# EAGLE design tarocco-v1.1 (EAGLE 7.3.0)
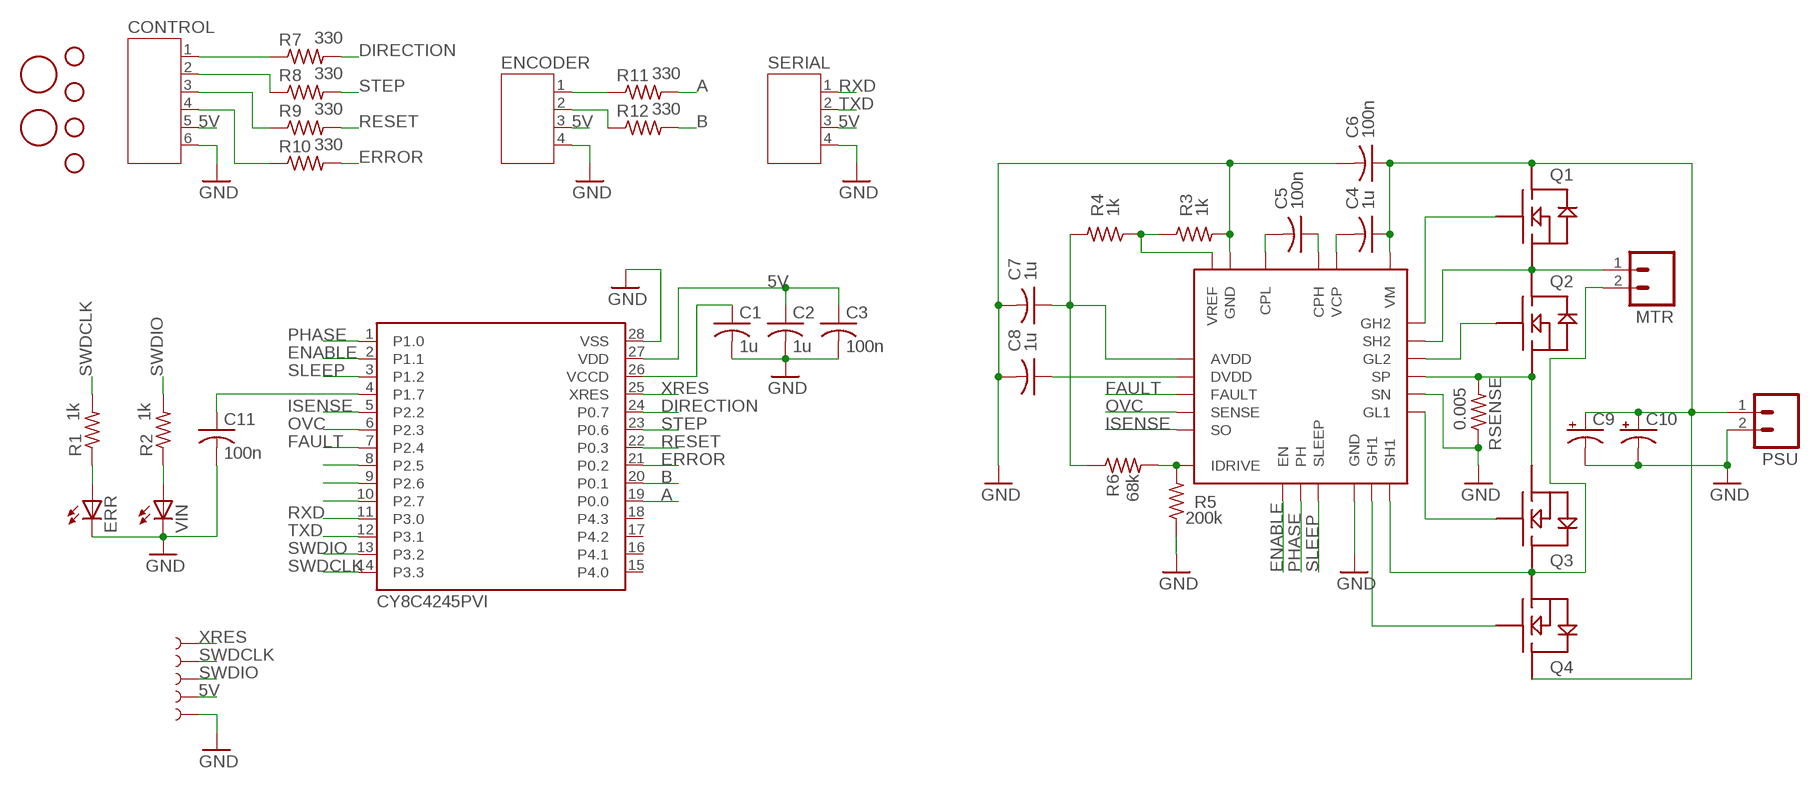
[diagram p0: schematic, sheet 1]

## Parts
8701  DRV8701  [VQFN24]
C1  1u  C-USC0603  [C0603]
C2  1u  C-USC0603  [C0603]
C3  100n  C-USC0603  [C0603]
C4  1u  C-USC0603  [C0603]
C5  100n  C-USC0603  [C0603]
C6  100n  C-USC0603  [C0603]
C7  1u  C-USC0603  [C0603]
C8  1u  C-USC0603  [C0603]
C9  CPOL-USE3.5-8  [E3,5-8]
C10  CPOL-USE3.5-8  [E3,5-8]
C11  100n  C-USC0603  [C0603]
CONTROL  JST-PH6  [JST-PH6]
ENCODER  JST-PH4  [JST-PH4]
ERR  LEDCHIP-LED0603  [CHIP-LED0603]
IC1  CY8C4545PVI  [SSOP28]
MTR  M023.5MM  [SCREWTERMINAL-3.5MM-2]
PSU  M023.5MM  [SCREWTERMINAL-3.5MM-2]
Q1  NEXFET_SINGLECSD18537NQ5A  [SON5X6]
Q2  NEXFET_SINGLECSD18537NQ5A  [SON5X6]
Q3  NEXFET_SINGLECSD18537NQ5A  [SON5X6]
Q4  NEXFET_SINGLECSD18537NQ5A  [SON5X6]
R1  1k  R-US_R0603  [R0603]
R2  1k  R-US_R0603  [R0603]
R3  1k  R-US_R0603  [R0603]
R4  1k  R-US_R0603  [R0603]
R5  200k  R-US_R0603  [R0603]
R6  68k  R-US_R0603  [R0603]
R7  330  R-US_R0603  [R0603]
R8  330  R-US_R0603  [R0603]
R9  330  R-US_R0603  [R0603]
R10  330  R-US_R0603  [R0603]
R11  330  R-US_R0603  [R0603]
R12  330  R-US_R0603  [R0603]
RSENSE  0.005  R-US_R2512  [R2512]
SERIAL  JST-PH4  [JST-PH4]
STANDOFF1  STAND-OFF  [STAND-OFF]
STANDOFF2  STAND-OFF  [STAND-OFF]
STANDOFF3  STAND-OFF  [STAND-OFF]
STANDOFF4  STAND-OFF  [STAND-OFF]
TP1  TEST-POINT3X5  [PAD.03X.05]
TP2  TEST-POINT3X5  [PAD.03X.05]
TP3  TEST-POINT3X5  [PAD.03X.05]
TP4  TEST-POINT3X5  [PAD.03X.05]
TP5  TEST-POINT3X5  [PAD.03X.05]
U$1  FIDUCIAL  [FIDUCIAL_1MM]
U$3  FIDUCIAL  [FIDUCIAL_1MM]
VIN  LEDCHIP-LED0603  [CHIP-LED0603]

## Nets
5V: C2.1 C3.1 CONTROL.5 ENCODER.3 IC1.27(VDD) SERIAL.3 TP4.P$1
A: IC1.19(P0.0) R11.2
B: IC1.20(P0.1) R12.2
DIRECTION: IC1.24(P0.7) R7.2
ENABLE: 8701.EN IC1.2(P1.1)
ERROR: IC1.21(P0.2) R10.2
FAULT: 8701.FAULT IC1.7(P2.4)
GND: 8701.GND@1(GND) 8701.GND@2(GND) 8701.GND@3(GND) 8701.SN C1.2 C2.2 C3.2 C6.2 C7.2 C8.2 C9.- C10.- C11.2 CONTROL.6 ENCODER.4 ERR.C IC1.28(VSS) PSU.2 R3.2 R5.1 RSENSE.1 SERIAL.4 TP5.P$1 VIN.C
ISENSE: 8701.SO IC1.5(P2.2)
N$1: 8701.GL1 Q3.GATE
N$2: 8701.SH1 MTR.2 Q3.DRAIN@1(DRAIN) Q3.DRAIN@2(DRAIN) Q3.DRAIN@3(DRAIN) Q3.DRAIN@4(DRAIN) Q3.DRAIN@5(DRAIN) Q4.SOURCE@1(SOURCE) Q4.SOURCE@2(SOURCE) Q4.SOURCE@3(SOURCE)
N$3: 8701.SH2 MTR.1 Q1.SOURCE@1(SOURCE) Q1.SOURCE@2(SOURCE) Q1.SOURCE@3(SOURCE) Q2.DRAIN@1(DRAIN) Q2.DRAIN@2(DRAIN) Q2.DRAIN@3(DRAIN) Q2.DRAIN@4(DRAIN) Q2.DRAIN@5(DRAIN)
N$4: 8701.GH2 Q1.GATE
N$5: 8701.SP Q2.SOURCE@1(SOURCE) Q2.SOURCE@2(SOURCE) Q2.SOURCE@3(SOURCE) Q3.SOURCE@1(SOURCE) Q3.SOURCE@2(SOURCE) Q3.SOURCE@3(SOURCE) RSENSE.2
N$6: 8701.GL2 Q2.GATE
N$7: 8701.GH1 Q4.GATE
N$8: ENCODER.1 R11.1
N$10: ENCODER.2 R12.1
N$11: 8701.VCP C4.2
N$12: 8701.CPL C5.2
N$13: 8701.CPH C5.1
N$14: CONTROL.1 R7.1
N$15: 8701.VREF R3.1 R4.1
N$16: 8701.AVDD C7.1 R4.2 R6.1
N$17: 8701.DVDD C8.1
N$18: CONTROL.2 R8.1
N$19: C1.1 IC1.26(VCCD)
N$20: CONTROL.3 R9.1
N$21: 8701.IDRIVE R5.2 R6.2
N$22: CONTROL.4 R10.1
N$23: 8701.VM C4.1 C6.1 C9.+ C10.+ PSU.1 Q1.DRAIN@1(DRAIN) Q1.DRAIN@2(DRAIN) Q1.DRAIN@3(DRAIN) Q1.DRAIN@4(DRAIN) Q1.DRAIN@5(DRAIN) Q4.DRAIN@1(DRAIN) Q4.DRAIN@2(DRAIN) Q4.DRAIN@3(DRAIN) Q4.DRAIN@4(DRAIN) Q4.DRAIN@5(DRAIN)
N$24: ERR.A R1.1
N$25: R2.1 VIN.A
N$29: C11.1 IC1.4(P1.7)
N$33: IC1.8(P2.5)
N$34: IC1.9(P2.6)
N$35: IC1.10(P2.7)
OVC: 8701.SENSE IC1.6(P2.3)
PHASE: 8701.PH IC1.1(P1.0)
RESET: IC1.22(P0.3) R9.2
RXD: IC1.11(P3.0) SERIAL.1
SLEEP: 8701.SLEEP IC1.3(P1.2)
STEP: IC1.23(P0.6) R8.2
SWDCLK: IC1.14(P3.3) R1.2 TP2.P$1
SWDIO: IC1.13(P3.2) R2.2 TP3.P$1
TXD: IC1.12(P3.1) SERIAL.2
XRES: IC1.25(XRES) TP1.P$1
Unconnected: IC1.15(P4.0) IC1.16(P4.1) IC1.17(P4.2) IC1.18(P4.3)

## Notes on the sheet
- CY8C4245PVI

## Library data of the parts
8701 = drv8x:DRV8701
C1-C8 C11 = adafruit:C-US: CAPACITOR, American symbol
C9 C10 = adafruit:CPOL-US: POLARIZED CAPACITOR, American symbol
CONTROL = jst-ph:JST-PH6
ENCODER SERIAL = jst-ph:JST-PH4
ERR VIN = adafruit:LED: LED OSRAM: - CHIPLED LG R971, LG N971, LY N971, LG Q971, LY Q971, LO R971, LY R971 LH N974, LH R974 LS Q976, LO Q976, LY Q976 LO Q996 - Hyper CHIPLED LW Q18S LB Q993, LB Q99A, LB R99A - SideLED LS A670, LO A670, LY A670, LG A670, LP A670 LB A673, LV A673, LT A673, LW A673 LH A674 LY A675 LS A676, LA A676, LO A676, LY A676, LW A676 LS A679, LY A679, LG A679 - Hyper Micro SIDELED® LS Y876, LA Y876, LO Y876, LY Y876 LT Y87S - SmartLED LW L88C, LW L88S LB L89C, LB L89S, LG L890 LS L89K, LO L89K, LY L89K LS L896, LA L896, LO L896, LY L896 - TOPLED LS T670, LO T670, LY T670, LG T670, LP T670 LSG T670, LSP T670, LSY T670, LOP T670, LYG T670 LG T671, LOG T671, LSG T671 LB T673, LV T673, LT T673, LW T673 LH T674 LS T676, LA T676, LO T676, LY T676, LB T676, LH T676, LSB T676, LW T676 LB T67C, LV T67C, LT T67C, LS T67K, LO T67K, LY T67K, LW E67C LS E67B, LA E67B, LO E67B, LY E67B, LB E67C, LV E67C, LT E67C LW T67C LS T679, LY T679, LG T679 LS T770, LO T770, LY T770, LG T770, LP T770 LB T773, LV T773, LT T773, LW T773 LH T774 LS E675, LA E675, LY E675, LS T675 LS T776, LA T776, LO T776, LY T776, LB T776 LHGB T686 LT T68C, LB T68C - Hyper Mini TOPLED® LB M676 - Mini TOPLED Santana® LG M470 LS M47K, LO M47K, LY M47K Source: http://www.osram.convergy.de/
IC1 = CY8C4200:CY8C4545PVI: CY8C4245 SSOP-28
MTR PSU = SparkFun-Connectors:M02: Standard 2-pin 0.1" header. Use with - straight break away headers ( PRT-00116) - right angle break away headers (PRT-00553) - swiss pins (PRT-00743) - machine pins (PRT-00117) - female headers (PRT-00115) Molex polarized connector foot print use with: PRT-08233 with associated crimp pins and housings. 2.54_SCREWTERM for use with PRT-10571. 3.5mm Screw Terminal footprints for PRT-08084 5mm Screw Terminal footprints for use with PRT-08432
Q1-Q4 = mosfet:NEXFET_SINGLE
R1-R12 RSENSE = adafruit:R-US_: RESISTOR, American symbol
STANDOFF1-STANDOFF4 = SparkFun-Electromechanical:STAND-OFF: #4 Stand Off This is the mechanical footprint for a #4 phillips button head screw. Use the keepout ring to avoid running the screw head into surrounding components. SKU : PRT-00447
TP1-TP5 = SparkFun-Passives:TEST-POINT: Bare copper test points for troubleshooting or ICT
U$1 U$3 = adafruit:FIDUCIAL: For use by pick and place machines to calibrate the vision/machine, 1mm By microbuilder.eu

## Board
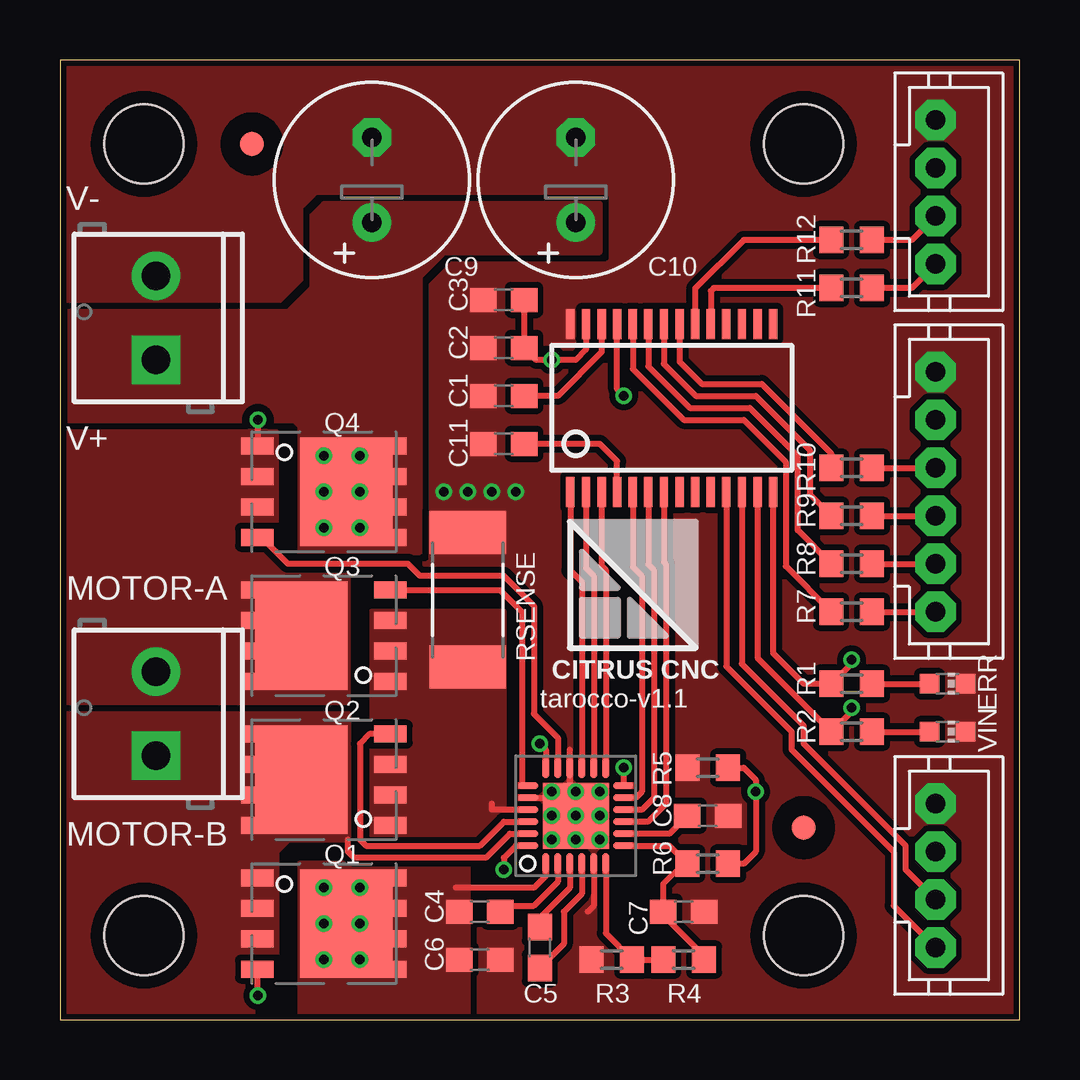
[diagram p1: board, top side]
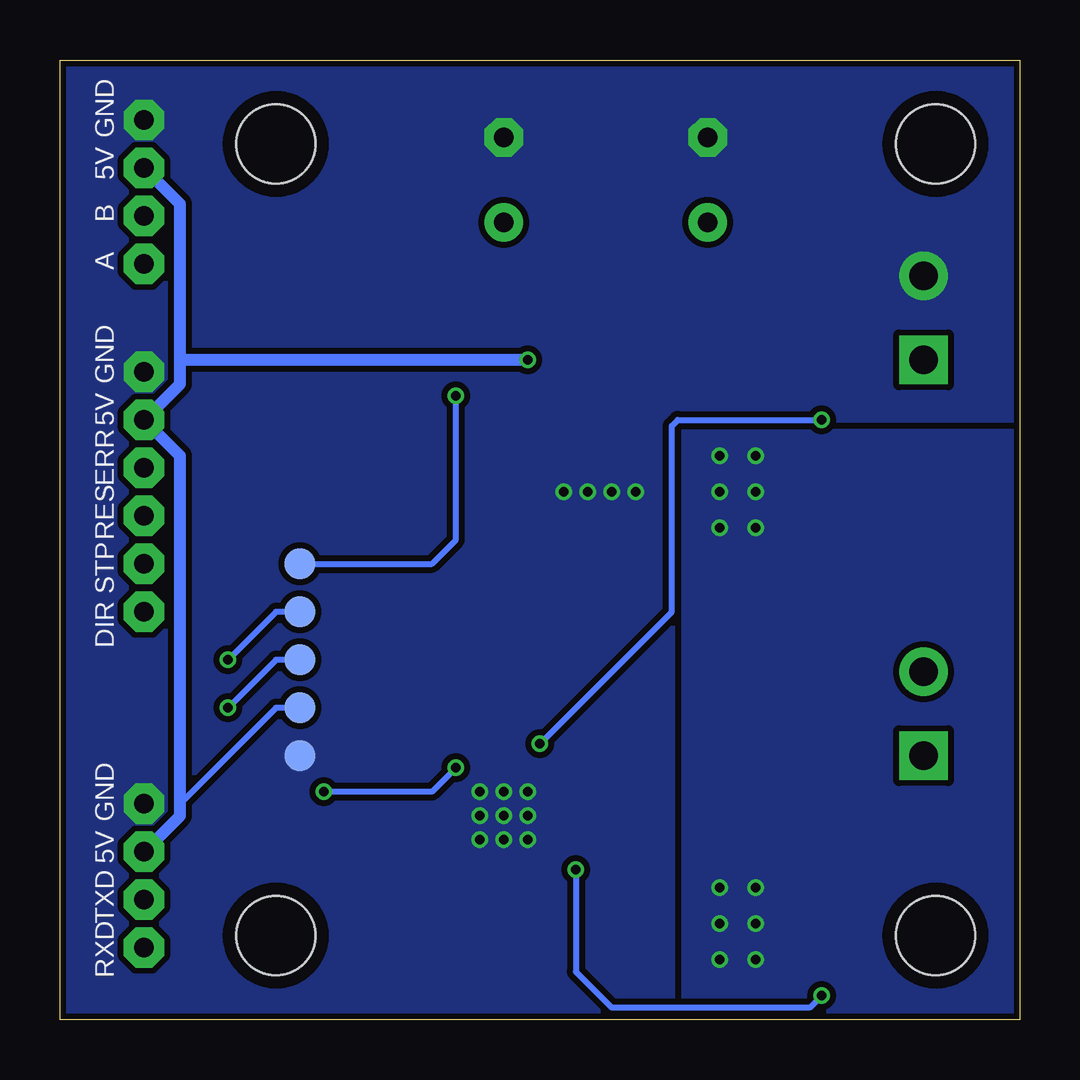
[diagram p2: board, bottom side, seen from below]

Size 40 x 40 mm. Coordinates in mm from the lower left corner, seen from the top.
Outline: 0,0 40,0 40,40 0,40 0,0
Copper layers (1*16): Top 0.035mm / dielectric 1.5mm / Bottom 0.035mm
Design rules "MF_Standard_2_Layer": minimum track width 5mil, minimum drill 12mil, track to track 5mil, track to pad 5mil, pad to pad 5mil, via to via 5mil, smd to smd 0mil, copper to edge 10mil, drill to drill 10mil, minimum pad ring 6mil, minimum via ring 6mil, stop-mask expansion 2mil, vias tented up to drill 25mil, thermal gap 10mil

### Footprints (pad centres in the part's own frame; a part is rotated, then mirrored left to right if it is on the bottom)
VQFN24 = smd 0.28 x 0.85: AVDD -1.25,-1.975; DVDD -0.75,-1.975; FAULT -0.25,-1.975; GH2 -1.25,1.975; GL1 1.25,1.975; GL2 -0.25,1.975; IDRIVE 1.25,-1.975; SENSE 0.25,-1.975; SH2 -0.75,1.975; SN 0.75,1.975; SO 0.75,-1.975; SP 0.25,1.975 | smd 0.85 x 0.28: CPH -1.975,0.25; CPL -1.975,-0.25; EN 1.975,-0.75; GH1 1.975,0.75; GND@1 1.975,0.25; GND@2 -1.975,-0.75; PH 1.975,-0.25; SH1 1.975,1.25; SLEEP 1.975,-1.25; VCP -1.975,0.75; VM -1.975,1.25; VREF -1.975,-1.25 | smd 2.75 x 2.75: GND@3 0,0
C0603 = smd 1.1 x 1: 1 -0.85,0; 2 0.85,0
E3,5-8 = drill 0.813 pad 1.6: + -1.778,0 | drill 0.813 pad 1.6 octagon: - 1.778,0
JST-PH6 = drill 0.813 pad 1.676 octagon: 1 5,0; 2 3,0; 3 1,0; 4 -1,0; 5 -3,0; 6 -5,0
JST-PH4 = drill 0.813 pad 1.676 octagon: 1 3,0; 2 1,0; 3 -1,0; 4 -3,0
CHIP-LED0603 = smd 0.8 x 0.8: A 0,-0.75; C 0,0.75
SSOP28 = smd 0.35 x 1.25: 1 -4.225,-3.5; 2 -3.575,-3.5; 3 -2.925,-3.5; 4 -2.275,-3.5; 5 -1.625,-3.5; 6 -0.975,-3.5; 7 -0.325,-3.5; 8 0.325,-3.5; 9 0.975,-3.5; 10 1.625,-3.5; 11 2.275,-3.5; 12 2.925,-3.5; 13 3.575,-3.5; 14 4.225,-3.5; 15 4.225,3.5; 16 3.575,3.5; 17 2.925,3.5; 18 2.275,3.5; 19 1.625,3.5; 20 0.975,3.5; 21 0.325,3.5; 22 -0.325,3.5; 23 -0.975,3.5; 24 -1.625,3.5; 25 -2.275,3.5; 26 -2.925,3.5; 27 -3.575,3.5; 28 -4.225,3.5
SCREWTERMINAL-3.5MM-2 = drill 1.2 pad 2.032 square: 1 0,0 | drill 1.2 pad 2.032: 2 3.5,0
SON5X6 = smd 0.59 x 0.71: DRAIN@1 -3.161,1.905; DRAIN@2 -3.161,0.635; DRAIN@3 -3.161,-0.635; DRAIN@4 -3.161,-1.905 | smd 3.85 x 4.52: DRAIN@5 -0.941,0 | smd 1.372 x 0.71: GATE 2.77,1.905; SOURCE@1 2.77,-1.905; SOURCE@2 2.77,-0.635; SOURCE@3 2.77,0.635
R0603 = smd 1 x 1.1: 1 -0.85,0; 2 0.85,0
R2512 = smd 1.8 x 3.2: 1 -2.8,0; 2 2.8,0
STAND-OFF = hole 3.302: 0,0
PAD.03X.05 = smd 1.27 x 1.27: P$1 0,0
FIDUCIAL_1MM = smd 1 x 1: 1 0,0

### Placement (x,y rotation side)
8701  21.5,8.5 90 top
C1  18.5,26 180 top
C2  18.5,28 180 top
C3  18.5,30 180 top
C4  17.5,4.5 0 top
C5  20,3 270 top
C6  17.5,2.5 0 top
C7  26,4.5 0 top
C8  27,8.5 0 top
C9  13,35 90 top
C10  21.5,35 90 top
C11  18.5,24 180 top
CONTROL  36.5,22 270 top
ENCODER  36.5,34.5 270 top
ERR  37,14 270 top
IC1  25.5,25.5 0 top
MTR  4,11 90 top
PSU  4,27.5 90 top
Q1  11,4 180 top
Q2  11,10 0 top
Q3  11,16 0 top
Q4  11,22 180 top
R1  33,14 180 top
R2  33,12 180 top
R3  23,2.5 180 top
R4  26,2.5 0 top
R5  27,10.5 0 top
R6  27,6.5 0 top
R7  33,17 180 top
R8  33,19 180 top
R9  33,21 180 top
R10  33,23 180 top
R11  33,30.5 180 top
R12  33,32.5 180 top
RSENSE  17,17.5 270 top
SERIAL  36.5,6 270 top
STANDOFF1  3.5,36.5 0 top
STANDOFF2  31,36.5 0 top
STANDOFF3  3.5,3.5 0 top
STANDOFF4  31,3.5 0 top
TP1  30,19 0 bottom
TP2  30,17 0 bottom
TP3  30,15 0 bottom
TP4  30,13 0 bottom
TP5  30,11 0 bottom
U$1  31,8 0 top
U$3  8,36.5 0 top
VIN  37,12 270 top

### Tracks (layer width: path | path; a pad name or v marks a point on that pad's centre or on a via)
5V  (via drill 0.4)
  Top 0.25: IC1.27 21.93,27.93 21.5,27.5 v20.5,27.5 19.85,27.5 C2.1 C3.1
  Bottom 0.25: TP4.P$1 31,13 35,9
  Bottom 0.5: SERIAL.3 35,8.5 35,9 35,23.5 CONTROL.5 35,26.5 35,27.5 | 35,27.5 35,34 ENCODER.3 | v20.5,27.5 35,27.5
A
  Top 0.25: R11.2 27.25,30.5 27.12,30.38 IC1.19
B
  Top 0.25: R12.2 28.5,32.5 26.48,30.48 IC1.20
DIRECTION
  Top 0.25: R7.2 30.25,18.9 30.25,23.25 28.5,25 26,25 23.88,27.12 IC1.24
ENABLE
  Top 0.25: IC1.2 21.93,18.82 22.25,18.5 8701.EN
ERROR
  Top 0.25: R10.2 32.15,23.6 29.25,26.5 26.75,26.5 25.82,27.43 IC1.21
FAULT
  Top 0.25: IC1.7 25.18,19.07 25.25,19 25.25,9 24.5,8.25 8701.FAULT
GND  (via drill 0.4)
  Top 0.25: 21,9 21,9.5 21.25,9.25 8701.GND@1 | 22,8 21.25,8.75 21.25,11.25 | 8701.SN 20.25,9.25 v20.5,9.5 | 8701.GND@2 22.25,4.75 22,4.5
  other vias: 21.5,9.5 22.5,9.5 20.5,8.5 20.5,7.5 22.5,8.5 21.5,7.5 22.5,7.5 21.5,8.5 16,22 17,22 18,22 19,22
  pour Bottom (isolate 0.25, rank 6, no thermals): 0,0 40,0 40,40 0,40
  pour Top (isolate 0.25, rank 6, no thermals): 0,0 40,0 40,40 0,40
ISENSE
  Top 0.25: IC1.5 23.88,18.88 24.25,18.5 24.25,9.5 24,9.25 8701.SO
N$1
  Top 0.25: Q3.GATE 18.34,17.91 19.25,17 19.25,9.75 8701.GL1
N$2  (via drill 0.4)
  Top 0.25: 8.1,23.91 Q4.SOURCE@1 8.23,25 v8.25,25 | v20,11.5 20.25,11.25 8701.SH1
  Bottom 0.25: v8.25,25 14.25,25 14.5,24.75 14.5,17 v20,11.5
  pour Top (isolate 0.25, rank 2, no thermals): 0,13.25 12,13.25 12,18.5 9.5,18.5 9,19 9,24.5 0,24.5
N$3
  Top 0.25: 12,7.5 12,7 12.25,6.75 17.75,6.75 18.75,7.75 8701.SH2
  pour Top (isolate 0.25, no thermals): 0,12.75 12,12.75 12,7.5 9.5,7.5 9,7 9,0 0,0
N$4  (via drill 0.4)
  Top 0.25: v18.5,6.25 18.5,6.75 19,7.25 8701.GH2 | v8.25,1 8.23,1 Q1.GATE
  Bottom 0.25: v18.5,6.25 18.5,2 17,0.5 8.75,0.5 v8.25,1
N$5
  Top 0.25: 8701.SP 18,8.75 18,9
  pour Top (isolate 0.25, no thermals): 13,7.5 18.5,7.5 18.5,17 13,17
N$6
  Top 0.25: Q2.GATE 12.9,11.9 12.5,11.5 12.5,7.5 12.75,7.25 17.5,7.25 18.5,8.25 8701.GL2
N$7
  Top 0.25: Q4.GATE 8.4,20.09 9.5,19 14.5,19 15,18.5 18.5,18.5 19.75,17.25 19.75,12.75 20.75,11.75 8701.GH1
N$8
  Top 0.25: ENCODER.1 35.5,30.5 R11.1
N$10
  Top 0.25: ENCODER.2 35.5,32.5 R12.1
N$11
  Top 0.25: C4.2 18.6,4.75 19.75,4.75 20.75,5.75 8701.VCP
N$12
  Top 0.25: C5.2 21,3.15 21,4.5 21.75,5.25 8701.CPL
N$13
  Top 0.25: 20,4 C5.1 20,4.25 21.25,5.5 8701.CPH
N$14
  Top 0.25: R7.1 CONTROL.1
N$15
  Top 0.25: R4.1 R3.1 22.75,3.6 8701.VREF
N$16
  Top 0.25: R4.2 26.85,2.65 25.15,4.35 C7.1 25.15,5.65 26,6.5 R6.1 25.4,7.25 8701.AVDD
N$17
  Top 0.25: C8.1 25.4,7.75 8701.DVDD
N$18
  Top 0.25: R8.1 CONTROL.2
N$19
  Top 0.25: IC1.26 22.57,27.82 20.75,26 C1.1
N$20
  Top 0.25: R9.1 CONTROL.3
N$21  (via drill 0.4)
  Top 0.25: 8701.IDRIVE 23.5,9.75 v23.5,10.5 | R5.2 28.5,10.5 29,10 v29,9.5 29,7 28.5,6.5 R6.2
  Bottom 0.25: v23.5,10.5 24.5,9.5 v29,9.5
N$22
  Top 0.25: R10.1 CONTROL.4
N$23  (via drill 0.4)
  Top 0.25: 16.5,5.5 19.75,5.5 20.25,6 8701.VM
  other vias: 11,5.5 11,4 11,2.5 12.5,2.5 12.5,4 12.5,5.5 11,23.5 11,22 11,20.5 12.5,23.5 12.5,22 12.5,20.5
  pour Top (isolate 0.25, no thermals): 17,6.5 10,6.5 10,0 17,0
  pour Top (isolate 0.3, no thermals): 0,29.5 0,25 9.75,25 10,24.75 10,19.5 15,19.5 15,31 16,32 22.5,32 22.5,34 11,34 10.5,33.5 10.5,30.5 9.5,29.5
  pour Bottom (isolate 0.25, no thermals): 0,24.5 14,24.5 14,0 0,0
N$24
  Top 0.25: R1.1 ERR.A
N$25
  Top 0.25: R2.1 VIN.A
N$29
  Top 0.25: IC1.4 23.23,23.27 22.5,24 C11.1
OVC
  Top 0.25: IC1.6 24.52,18.98 24.75,18.75 24.75,9.25 24.25,8.75 8701.SENSE
PHASE
  Top 0.25: IC1.1 21.27,18.73 21.75,18.25 8701.PH
RESET
  Top 0.25: R9.2 31.25,21.9 31.25,23.75 29,26 26.5,26 25.18,27.32 IC1.22
RXD
  Top 0.25: IC1.11 27.77,14.72 30.5,12 30.5,11.25 34.75,7 34.75,4.75 SERIAL.1
SLEEP
  Top 0.25: IC1.3 22.57,18.93 22.75,18.75 8701.SLEEP
STEP
  Top 0.25: R8.2 30.75,20.4 30.75,23.5 28.75,25.5 26.25,25.5 24.52,27.23 IC1.23
SWDCLK  (via drill 0.4)
  Top 0.25: IC1.14 29.73,15.28 31,14 R1.2 33,14.85 v33,15
  Bottom 0.25: TP2.P$1 31,17 v33,15
SWDIO  (via drill 0.4)
  Top 0.25: IC1.13 29.07,15.07 R2.2 33,12.85 v33,13
  Bottom 0.25: TP3.P$1 31,15 v33,13
TXD
  Top 0.25: IC1.12 28.43,14.82 31,12.25 31,11.5 35.25,7.25 35.25,6.25 SERIAL.2
XRES  (via drill 0.4)
  Top 0.25: v23.5,26 23.23,26.27 IC1.25
  Bottom 0.25: v23.5,26 23.5,20 24.5,19 TP1.P$1

### Text on the board
tNames: V- | V+ | MOTOR-A | CITRUS CNC | tarocco-v1.1 | MOTOR-B
bNames: GND | 5V | B | A | GND | 5V | ERR | RES | STP | DIR | GND | 5V | TXD | RXD
Measures: 3.5 | 27.5 | 40 | 33 | 3.5 | 40 | All dimensions in mm
Document: GND | VLOGIC | B | A | V- | V+ | GND | VLOGIC | ERROR | RESET | STEP | DIRECTION | MOTOR-A | MOTOR-B | GND | VLOGIC | TXD | RXD